# Altium schematic sheet 11.RK3568_DDR PHY.SchDoc
size 420 x 297 mm
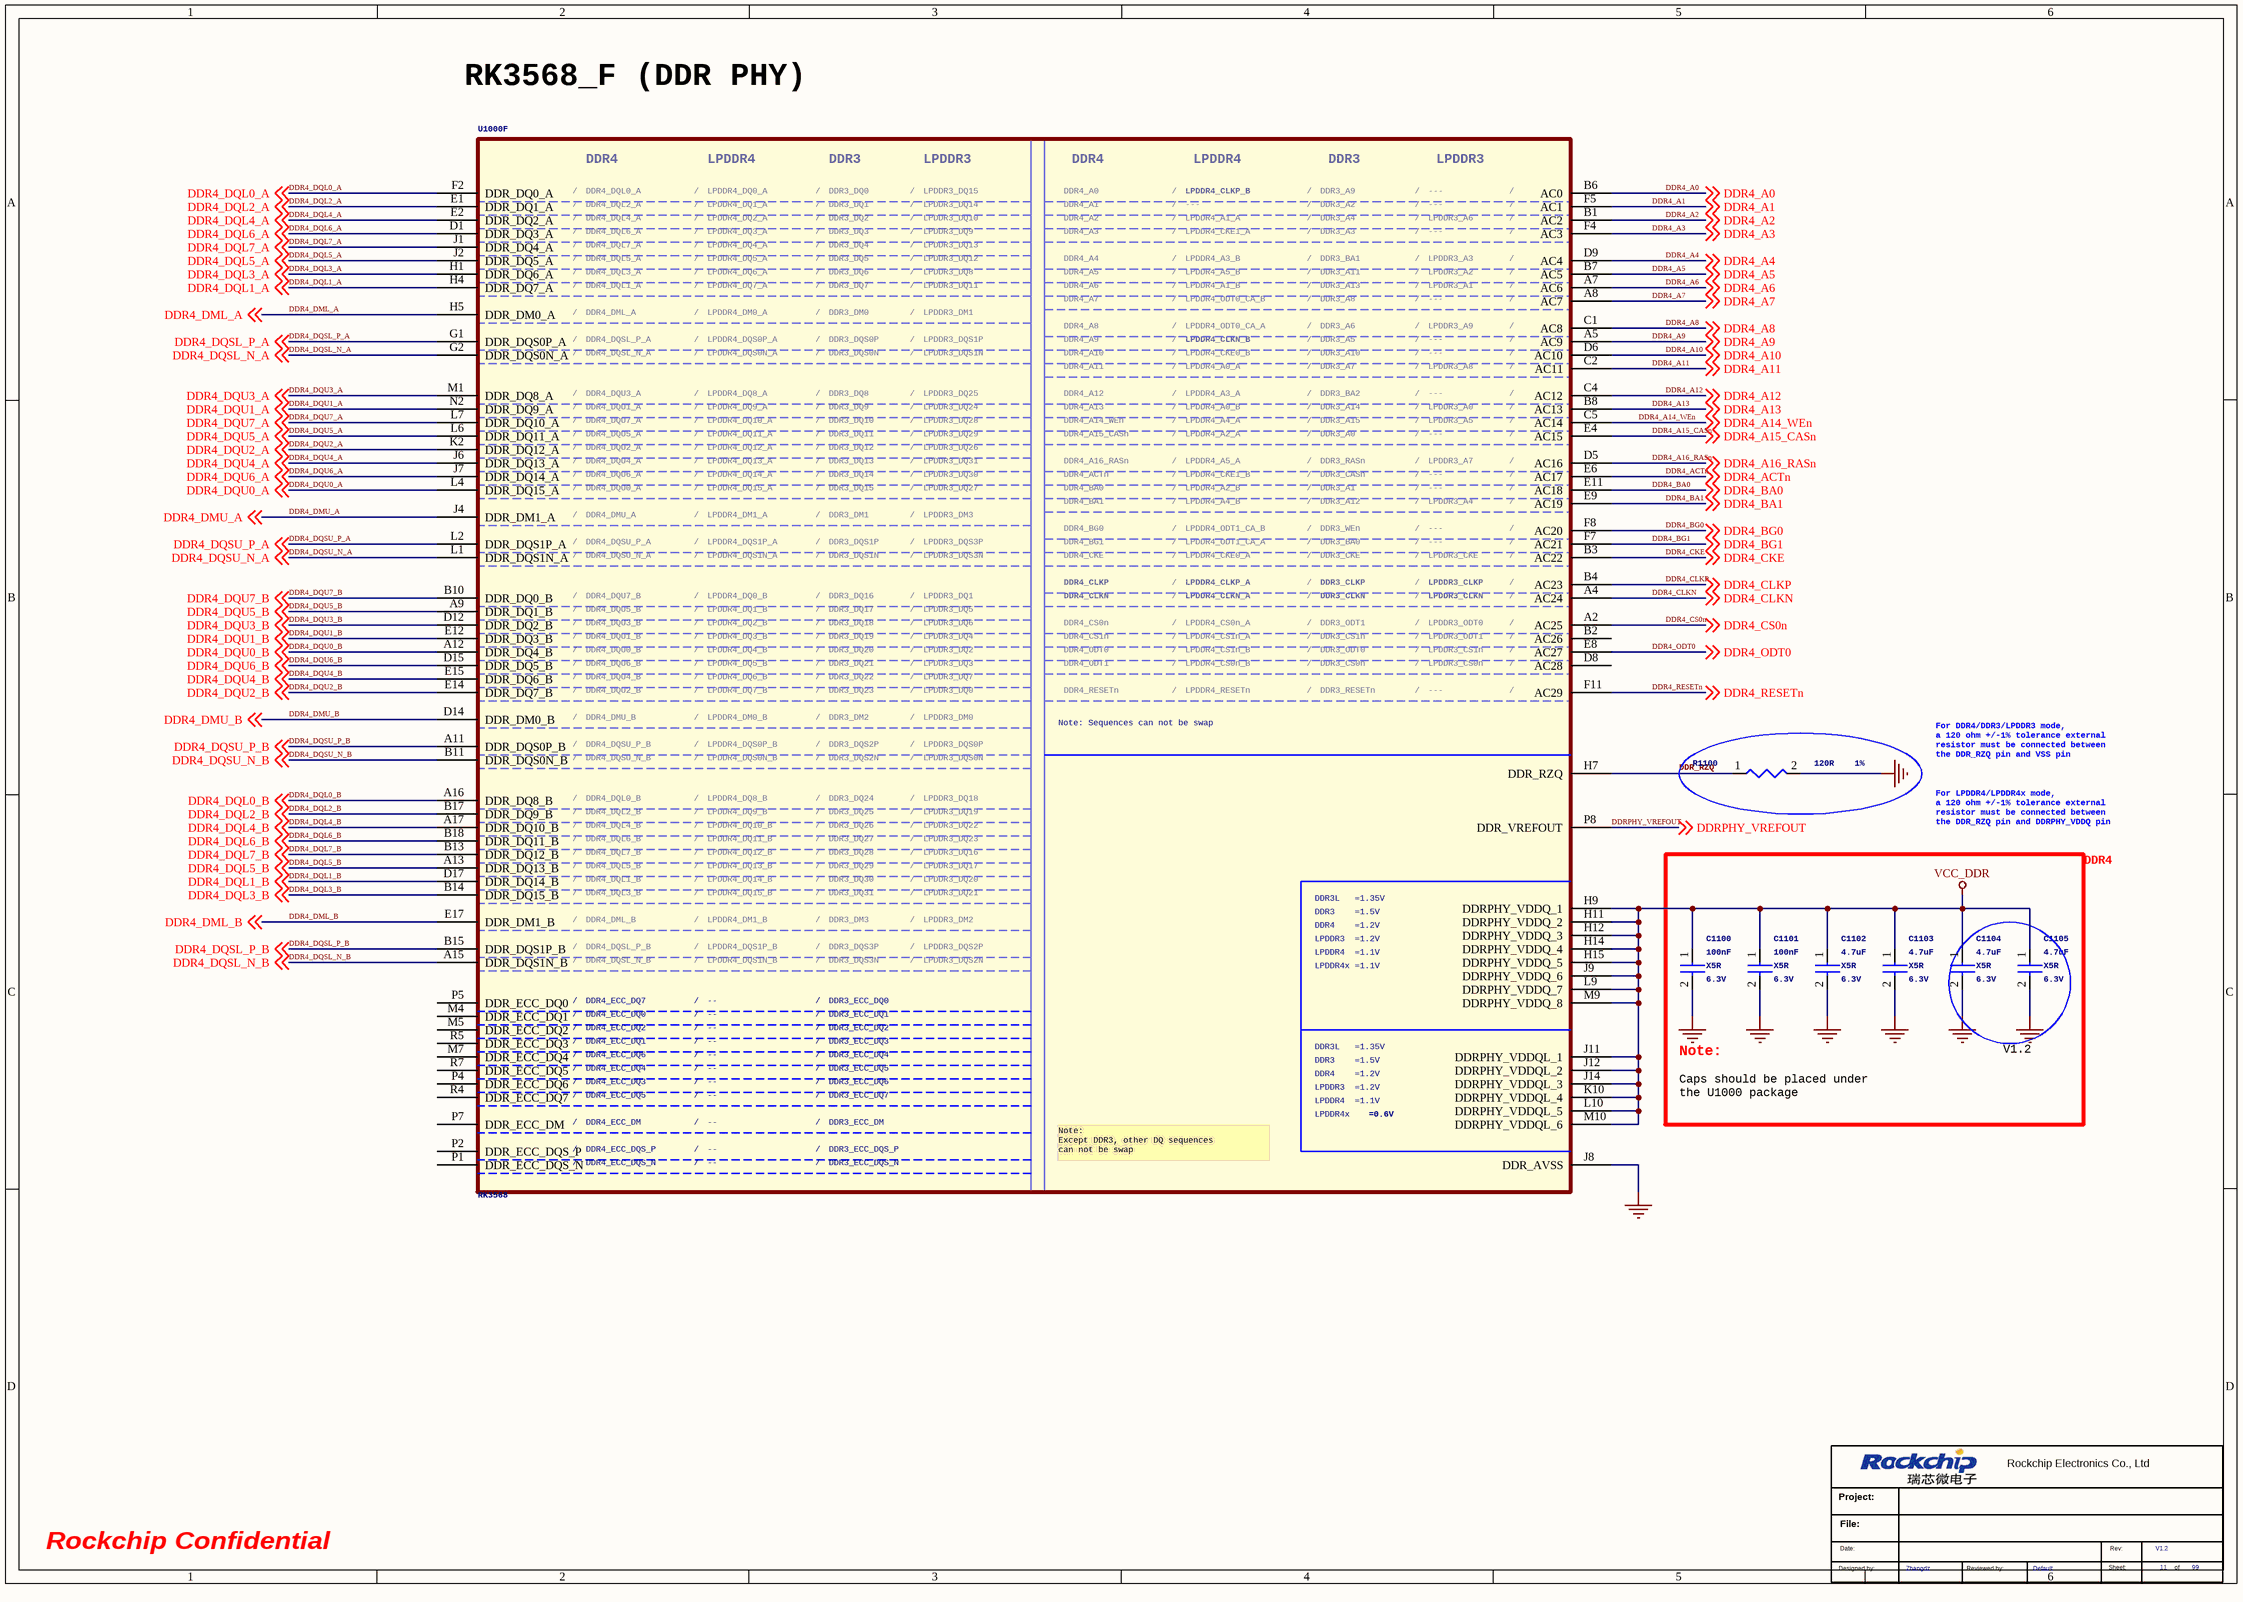
[diagram p0: 11.RK3568_DDR PHY.SchDoc]

## Parts
*  Schematic Page Count: 99  Schematic Page Number: 11  Designer: Zhangdz  Revision: V1.2  Check: Default  (hidden comment: Rockchip_new)  (graphical)
C1100  100nF  Voltage: 6.3V  Dielectric: X5R  [C0201]
C1101  100nF  Voltage: 6.3V  Dielectric: X5R  [C0201]
C1102  4.7uF  Voltage: 6.3V  Dielectric: X5R  [C0402]
C1103  4.7uF  Voltage: 6.3V  Dielectric: X5R  [C0402]
C1104  4.7uF  Voltage: 6.3V  Dielectric: X5R  [C0402]
C1105  4.7uF  Voltage: 6.3V  Dielectric: X5R  [C0402]
R1100  120R  Tolerance: 1%  [R0201]
U1000  RK3568  [BGA636_19R00X19R00X1R20]  (part F of 23)

## Blocks framed on the sheet
Note:: C1100-C1105

## Nets
GND: C1100.2 C1101.2 C1102.2 C1103.2 C1104.2 C1105.2 R1100.2 U1000.J8(DDR_AVSS)
VCC_DDR: C1100.1 C1101.1 C1102.1 C1103.1 C1104.1 C1105.1 U1000.H9(DDRPHY_VDDQ_1) U1000.H11(DDRPHY_VDDQ_2) U1000.H12(DDRPHY_VDDQ_3) U1000.H14(DDRPHY_VDDQ_4) U1000.H15(DDRPHY_VDDQ_5) U1000.J9(DDRPHY_VDDQ_6) U1000.J11(DDRPHY_VDDQL_1) U1000.J12(DDRPHY_VDDQL_2) U1000.J14(DDRPHY_VDDQL_3) U1000.K10(DDRPHY_VDDQL_4) U1000.L9(DDRPHY_VDDQ_7) U1000.L10(DDRPHY_VDDQL_5) U1000.M9(DDRPHY_VDDQ_8) U1000.M10(DDRPHY_VDDQL_6)
DDR4_A0: U1000.B6(AC0) ; off-sheet DDR4_A0
DDR4_A1: U1000.F5(AC1) ; off-sheet DDR4_A1
DDR4_A2: U1000.B1(AC2) ; off-sheet DDR4_A2
DDR4_A3: U1000.F4(AC3) ; off-sheet DDR4_A3
DDR4_A4: U1000.D9(AC4) ; off-sheet DDR4_A4
DDR4_A5: U1000.B7(AC5) ; off-sheet DDR4_A5
DDR4_A6: U1000.A7(AC6) ; off-sheet DDR4_A6
DDR4_A7: U1000.A8(AC7) ; off-sheet DDR4_A7
DDR4_A8: U1000.C1(AC8) ; off-sheet DDR4_A8
DDR4_A9: U1000.A5(AC9) ; off-sheet DDR4_A9
DDR4_A10: U1000.D6(AC10) ; off-sheet DDR4_A10
DDR4_A11: U1000.C2(AC11) ; off-sheet DDR4_A11
DDR4_A12: U1000.C4(AC12) ; off-sheet DDR4_A12
DDR4_A13: U1000.B8(AC13) ; off-sheet DDR4_A13
DDR4_A14_WEn: U1000.C5(AC14) ; off-sheet DDR4_A14_WEn
DDR4_A15_CASn: U1000.E4(AC15) ; off-sheet DDR4_A15_CASn
DDR4_A16_RASn: U1000.D5(AC16) ; off-sheet DDR4_A16_RASn
DDR4_ACTn: U1000.E6(AC17) ; off-sheet DDR4_ACTn
DDR4_BA0: U1000.E11(AC18) ; off-sheet DDR4_BA0
DDR4_BA1: U1000.E9(AC19) ; off-sheet DDR4_BA1
DDR4_BG0: U1000.F8(AC20) ; off-sheet DDR4_BG0
DDR4_BG1: U1000.F7(AC21) ; off-sheet DDR4_BG1
DDR4_CKE: U1000.B3(AC22) ; off-sheet DDR4_CKE
DDR4_CLKN: U1000.A4(AC24) ; off-sheet DDR4_CLKN
DDR4_CLKP: U1000.B4(AC23) ; off-sheet DDR4_CLKP
DDR4_CS0n: U1000.A2(AC25) ; off-sheet DDR4_CS0n
DDR4_DML_A: U1000.H5(DDR_DM0_A) ; off-sheet DDR4_DML_A
DDR4_DML_B: U1000.E17(DDR_DM1_B) ; off-sheet DDR4_DML_B
DDR4_DMU_A: U1000.J4(DDR_DM1_A) ; off-sheet DDR4_DMU_A
DDR4_DMU_B: U1000.D14(DDR_DM0_B) ; off-sheet DDR4_DMU_B
DDR4_DQL0_A: U1000.F2(DDR_DQ0_A) ; off-sheet DDR4_DQL0_A
DDR4_DQL0_B: U1000.A16(DDR_DQ8_B) ; off-sheet DDR4_DQL0_B
DDR4_DQL1_A: U1000.H4(DDR_DQ7_A) ; off-sheet DDR4_DQL1_A
DDR4_DQL1_B: U1000.D17(DDR_DQ14_B) ; off-sheet DDR4_DQL1_B
DDR4_DQL2_A: U1000.E1(DDR_DQ1_A) ; off-sheet DDR4_DQL2_A
DDR4_DQL2_B: U1000.B17(DDR_DQ9_B) ; off-sheet DDR4_DQL2_B
DDR4_DQL3_A: U1000.H1(DDR_DQ6_A) ; off-sheet DDR4_DQL3_A
DDR4_DQL3_B: U1000.B14(DDR_DQ15_B) ; off-sheet DDR4_DQL3_B
DDR4_DQL4_A: U1000.E2(DDR_DQ2_A) ; off-sheet DDR4_DQL4_A
DDR4_DQL4_B: U1000.A17(DDR_DQ10_B) ; off-sheet DDR4_DQL4_B
DDR4_DQL5_A: U1000.J2(DDR_DQ5_A) ; off-sheet DDR4_DQL5_A
DDR4_DQL5_B: U1000.A13(DDR_DQ13_B) ; off-sheet DDR4_DQL5_B
DDR4_DQL6_A: U1000.D1(DDR_DQ3_A) ; off-sheet DDR4_DQL6_A
DDR4_DQL6_B: U1000.B18(DDR_DQ11_B) ; off-sheet DDR4_DQL6_B
DDR4_DQL7_A: U1000.J1(DDR_DQ4_A) ; off-sheet DDR4_DQL7_A
DDR4_DQL7_B: U1000.B13(DDR_DQ12_B) ; off-sheet DDR4_DQL7_B
DDR4_DQSL_N_A: U1000.G2(DDR_DQS0N_A) ; off-sheet DDR4_DQSL_N_A
DDR4_DQSL_N_B: U1000.A15(DDR_DQS1N_B) ; off-sheet DDR4_DQSL_N_B
DDR4_DQSL_P_A: U1000.G1(DDR_DQS0P_A) ; off-sheet DDR4_DQSL_P_A
DDR4_DQSL_P_B: U1000.B15(DDR_DQS1P_B) ; off-sheet DDR4_DQSL_P_B
DDR4_DQSU_N_A: U1000.L1(DDR_DQS1N_A) ; off-sheet DDR4_DQSU_N_A
DDR4_DQSU_N_B: U1000.B11(DDR_DQS0N_B) ; off-sheet DDR4_DQSU_N_B
DDR4_DQSU_P_A: U1000.L2(DDR_DQS1P_A) ; off-sheet DDR4_DQSU_P_A
DDR4_DQSU_P_B: U1000.A11(DDR_DQS0P_B) ; off-sheet DDR4_DQSU_P_B
DDR4_DQU0_A: U1000.L4(DDR_DQ15_A) ; off-sheet DDR4_DQU0_A
DDR4_DQU0_B: U1000.A12(DDR_DQ4_B) ; off-sheet DDR4_DQU0_B
DDR4_DQU1_A: U1000.N2(DDR_DQ9_A) ; off-sheet DDR4_DQU1_A
DDR4_DQU1_B: U1000.E12(DDR_DQ3_B) ; off-sheet DDR4_DQU1_B
DDR4_DQU2_A: U1000.K2(DDR_DQ12_A) ; off-sheet DDR4_DQU2_A
DDR4_DQU2_B: U1000.E14(DDR_DQ7_B) ; off-sheet DDR4_DQU2_B
DDR4_DQU3_A: U1000.M1(DDR_DQ8_A) ; off-sheet DDR4_DQU3_A
DDR4_DQU3_B: U1000.D12(DDR_DQ2_B) ; off-sheet DDR4_DQU3_B
DDR4_DQU4_A: U1000.J6(DDR_DQ13_A) ; off-sheet DDR4_DQU4_A
DDR4_DQU4_B: U1000.E15(DDR_DQ6_B) ; off-sheet DDR4_DQU4_B
DDR4_DQU5_A: U1000.L6(DDR_DQ11_A) ; off-sheet DDR4_DQU5_A
DDR4_DQU5_B: U1000.A9(DDR_DQ1_B) ; off-sheet DDR4_DQU5_B
DDR4_DQU6_A: U1000.J7(DDR_DQ14_A) ; off-sheet DDR4_DQU6_A
DDR4_DQU6_B: U1000.D15(DDR_DQ5_B) ; off-sheet DDR4_DQU6_B
DDR4_DQU7_A: U1000.L7(DDR_DQ10_A) ; off-sheet DDR4_DQU7_A
DDR4_DQU7_B: U1000.B10(DDR_DQ0_B) ; off-sheet DDR4_DQU7_B
DDR4_ODT0: U1000.E8(AC27) ; off-sheet DDR4_ODT0
DDR4_RESETn: U1000.F11(AC29) ; off-sheet DDR4_RESETn
DDR_RZQ: R1100.1 U1000.H7(DDR_RZQ)
DDRPHY_VREFOUT: U1000.P8(DDR_VREFOUT) ; off-sheet DDRPHY_VREFOUT

Not connected (* = marked no-connect by the designer): U1000 B2(AC26) D8(AC28) M4(DDR_ECC_DQ1) M5(DDR_ECC_DQ2) M7(DDR_ECC_DQ4) P1(DDR_ECC_DQS_N) P2(DDR_ECC_DQS_P) P4(DDR_ECC_DQ6) P5(DDR_ECC_DQ0) P7(DDR_ECC_DM) R4(DDR_ECC_DQ7) R5(DDR_ECC_DQ3) R7(DDR_ECC_DQ5)

## Notes on the sheet
- RK3568_F (DDR PHY)
- For DDR4/DDR3/LPDDR3 mode,
  a 120 ohm +/-1% tolerance external
  resistor must be connected between
  the DDR_RZQ pin and VSS pin
- For LPDDR4/LPDDR4x mode,
  a 120 ohm +/-1% tolerance external
  resistor must be connected between
  the DDR_RZQ pin and DDRPHY_VDDQ pin
- DDR4
- V1.2
- Caps should be placed under
  the U1000 package
- Rockchip Confidential
- (in symbol Rockchip_new) Rockchip Electronics Co., Ltd; Project:; File:; Date:; Rev:; Sheet:; of; Designed by:; Reviewed by:
- (in symbol SOC_RK3568, part F) DDR4; LPDDR4; DDR3; LPDDR3; /; DDR4_DQL0_A; LPDDR4_DQ0_A; DDR3_DQ0; LPDDR3_DQ15; DDR4_A0; LPDDR4_CLKP_B; DDR3_A9; ---; DDR4_DQL2_A; LPDDR4_DQ1_A; DDR3_DQ1; LPDDR3_DQ14; DDR4_A1; DDR3_A2; DDR4_DQL4_A; LPDDR4_DQ2_A; DDR3_DQ2; LPDDR3_DQ10; DDR4_A2; LPDDR4_A1_A; DDR3_A4; LPDDR3_A6; DDR4_DQL6_A; LPDDR4_DQ3_A; DDR3_DQ3; LPDDR3_DQ9; DDR4_A3; LPDDR4_CKE1_A; DDR3_A3; DDR4_DQL7_A; LPDDR4_DQ4_A; DDR3_DQ4; LPDDR3_DQ13; DDR4_DQL5_A; LPDDR4_DQ5_A; DDR3_DQ5; LPDDR3_DQ12; DDR4_A4; LPDDR4_A3_B; DDR3_BA1; LPDDR3_A3; DDR4_DQL3_A; LPDDR4_DQ6_A; DDR3_DQ6; LPDDR3_DQ8; DDR4_A5; LPDDR4_A5_B; DDR3_A11; LPDDR3_A2; DDR4_DQL1_A; LPDDR4_DQ7_A; DDR3_DQ7; LPDDR3_DQ11; DDR4_A6; LPDDR4_A1_B; DDR3_A13; LPDDR3_A1; DDR4_A7; LPDDR4_ODT0_CA_B; DDR3_A8; DDR4_DML_A; LPDDR4_DM0_A; DDR3_DM0; LPDDR3_DM1; DDR4_A8; LPDDR4_ODT0_CA_A; DDR3_A6; LPDDR3_A9; DDR4_DQSL_P_A; LPDDR4_DQS0P_A; DDR3_DQS0P; LPDDR3_DQS1P; DDR4_A9; LPDDR4_CLKN_B; DDR3_A5; DDR4_DQSL_N_A; LPDDR4_DQS0N_A; DDR3_DQS0N; LPDDR3_DQS1N; DDR4_A10; LPDDR4_CKE0_B; DDR3_A10; DDR4_A11; LPDDR4_A0_A; DDR3_A7; LPDDR3_A8; DDR4_DQU3_A; LPDDR4_DQ8_A; DDR3_DQ8; LPDDR3_DQ25; DDR4_A12; LPDDR4_A3_A; DDR3_BA2; DDR4_DQU1_A; LPDDR4_DQ9_A; DDR3_DQ9; LPDDR3_DQ24; DDR4_A13; LPDDR4_A0_B; DDR3_A14; LPDDR3_A0; DDR4_DQU7_A; LPDDR4_DQ10_A; DDR3_DQ10; LPDDR3_DQ28; DDR4_A14_WEn; LPDDR4_A4_A; DDR3_A15; LPDDR3_A5; DDR4_DQU5_A; LPDDR4_DQ11_A; DDR3_DQ11; LPDDR3_DQ29; DDR4_A15_CASn; LPDDR4_A2_A; DDR3_A0; DDR4_DQU2_A; LPDDR4_DQ12_A; DDR3_DQ12; LPDDR3_DQ26; DDR4_DQU4_A; LPDDR4_DQ13_A; DDR3_DQ13; LPDDR3_DQ31; DDR4_A16_RASn; LPDDR4_A5_A; DDR3_RASn; LPDDR3_A7; DDR4_DQU6_A; LPDDR4_DQ14_A; DDR3_DQ14; LPDDR3_DQ30; DDR4_ACTn; LPDDR4_CKE1_B; DDR3_CASn; DDR4_DQU0_A; LPDDR4_DQ15_A; DDR3_DQ15; LPDDR3_DQ27; DDR4_BA0; LPDDR4_A2_B; DDR3_A1; DDR4_BA1; LPDDR4_A4_B; DDR3_A12; LPDDR3_A4; DDR4_DMU_A; LPDDR4_DM1_A; DDR3_DM1; LPDDR3_DM3; DDR4_BG0; LPDDR4_ODT1_CA_B; DDR3_WEn; DDR4_DQSU_P_A; LPDDR4_DQS1P_A; DDR3_DQS1P; LPDDR3_DQS3P; DDR4_BG1; LPDDR4_ODT1_CA_A; DDR3_BA0; DDR4_DQSU_N_A; LPDDR4_DQS1N_A; DDR3_DQS1N; LPDDR3_DQS3N; DDR4_CKE; LPDDR4_CKE0_A; DDR3_CKE; LPDDR3_CKE; DDR4_CLKP; LPDDR4_CLKP_A; DDR3_CLKP; LPDDR3_CLKP; DDR4_DQU7_B; LPDDR4_DQ0_B; DDR3_DQ16; LPDDR3_DQ1; DDR4_CLKN; LPDDR4_CLKN_A; DDR3_CLKN; LPDDR3_CLKN; DDR4_DQU5_B; LPDDR4_DQ1_B; DDR3_DQ17; LPDDR3_DQ5; DDR4_DQU3_B; LPDDR4_DQ2_B; DDR3_DQ18; LPDDR3_DQ6; DDR4_CS0n; LPDDR4_CS0n_A; DDR3_ODT1; LPDDR3_ODT0; DDR4_DQU1_B; LPDDR4_DQ3_B; DDR3_DQ19; LPDDR3_DQ4; DDR4_CS1n; LPDDR4_CS1n_A; DDR3_CS1n; LPDDR3_ODT1; DDR4_DQU0_B; LPDDR4_DQ4_B; DDR3_DQ20; LPDDR3_DQ2; DDR4_ODT0; LPDDR4_CS1n_B; DDR3_ODT0; LPDDR3_CS1n; DDR4_DQU6_B; LPDDR4_DQ5_B; DDR3_DQ21; LPDDR3_DQ3; DDR4_ODT1; LPDDR4_CS0n_B; DDR3_CS0n; LPDDR3_CS0n; DDR4_DQU4_B; LPDDR4_DQ6_B; DDR3_DQ22; LPDDR3_DQ7; DDR4_DQU2_B; LPDDR4_DQ7_B; DDR3_DQ23; LPDDR3_DQ0; DDR4_RESETn; LPDDR4_RESETn; DDR3_RESETn; DDR4_DMU_B; LPDDR4_DM0_B; DDR3_DM2; LPDDR3_DM0; Note: Sequences can not be swap; DDR4_DQSU_P_B; LPDDR4_DQS0P_B; DDR3_DQS2P; LPDDR3_DQS0P; DDR4_DQSU_N_B; LPDDR4_DQS0N_B; DDR3_DQS2N; LPDDR3_DQS0N; DDR4_DQL0_B; LPDDR4_DQ8_B; DDR3_DQ24; LPDDR3_DQ18; DDR4_DQL2_B; LPDDR4_DQ9_B; DDR3_DQ25; LPDDR3_DQ19; DDR4_DQL4_B; LPDDR4_DQ10_B; DDR3_DQ26; LPDDR3_DQ22; DDR4_DQL6_B; LPDDR4_DQ11_B; DDR3_DQ27; LPDDR3_DQ23; DDR4_DQL7_B; LPDDR4_DQ12_B; DDR3_DQ28; LPDDR3_DQ16; DDR4_DQL5_B; LPDDR4_DQ13_B; DDR3_DQ29; LPDDR3_DQ17; DDR4_DQL1_B; LPDDR4_DQ14_B; DDR3_DQ30; LPDDR3_DQ20; DDR4_DQL3_B; LPDDR4_DQ15_B; DDR3_DQ31; LPDDR3_DQ21; DDR3L   =1.35V; DDR3    =1.5V; DDR4_DML_B; LPDDR4_DM1_B; DDR3_DM3; LPDDR3_DM2; DDR4    =1.2V; LPDDR3  =1.2V; DDR4_DQSL_P_B; LPDDR4_DQS1P_B; DDR3_DQS3P; LPDDR3_DQS2P; LPDDR4  =1.1V; DDR4_DQSL_N_B; LPDDR4_DQS1N_B; DDR3_DQS3N; LPDDR3_DQS2N; LPDDR4x =1.1V; DDR4_ECC_DQ7; --; DDR3_ECC_DQ0; DDR4_ECC_DQ0; DDR3_ECC_DQ1; DDR4_ECC_DQ2; DDR3_ECC_DQ2; DDR4_ECC_DQ1; DDR3_ECC_DQ3; DDR4_ECC_DQ6; DDR3_ECC_DQ4; DDR4_ECC_DQ4; DDR3_ECC_DQ5; DDR4_ECC_DQ3; DDR3_ECC_DQ6; DDR4_ECC_DQ5; DDR3_ECC_DQ7; LPDDR4x; DDR4_ECC_DM; DDR3_ECC_DM; DDR4_ECC_DQS_P; DDR3_ECC_DQS_P; Note: / Except DDR3, other DQ sequences / can not be swap; DDR4_ECC_DQS_N; DDR3_ECC_DQS_N

## Library data of the parts
* = Rockchip_new: Page Number: 8; Page Count: 37; Revcode: V1.2
C1100 C1101 = CAP NP: cap,100.00nF,+/-10%,6.3V,X5R,C0201; Manufacturer PN: C0603X5R0J104K030BC; Manufacturer: TDK; Tolerance: 10%; Priority: A; Created by: JJJ; Part Type: C0201; RK PN: C0603X5R0J104K030BC
C1102 C1104 C1105 = CAP NP: cap,4.70uF,+/-10%,6.3V,X5R,C0402; Manufacturer: TDK; RK PN: C1005X5R0J475K050BC; Priority: A; Tolerance: 10%; Part Type: C0402; Manufacturer PN: C1005X5R0J475K050BC; Created by: JJJ
C1103 = CAP NP: cap,4.70uF,+/-10%,6.3V,X5R,C0402; Manufacturer PN: C1005X5R0J475K050BC; Manufacturer: TDK; Tolerance: 10%; Priority: A; Created by: JJJ; Part Type: C0402; RK PN: C1005X5R0J475K050BC
R1100 = RESISTOR: 通用厚膜电阻,120R,+/-1%,R0201,1/20W.; Manufacturer PN: RC0201FR-07120RL; Manufacturer: YAGEO; Wattage: 1/20W; Priority: A; Created by: YTL; Part Type: 通用厚膜电阻; RK PN: RC0201FR-07120RL
U1000 = SOC_RK3568: ROCKCHIP SOC; Manufacturer: Rockchip (瑞芯微); SPLIT_INST: TRUE; SWAP_INFO: (S1+S2+S3+S4+S5+S6+S7+S8+S9+S10+S11+S12+S13+S14+S15+S16+S17+S18+S19+S20+S21+S22+S23); Priority: A; Created by: JJJ; Manufacturer PN: RK3568; Part Type: SOC; RK PN: RK3568